# EAGLE design Zio Rotary Encoder Sensor (EAGLE 8.6.1)
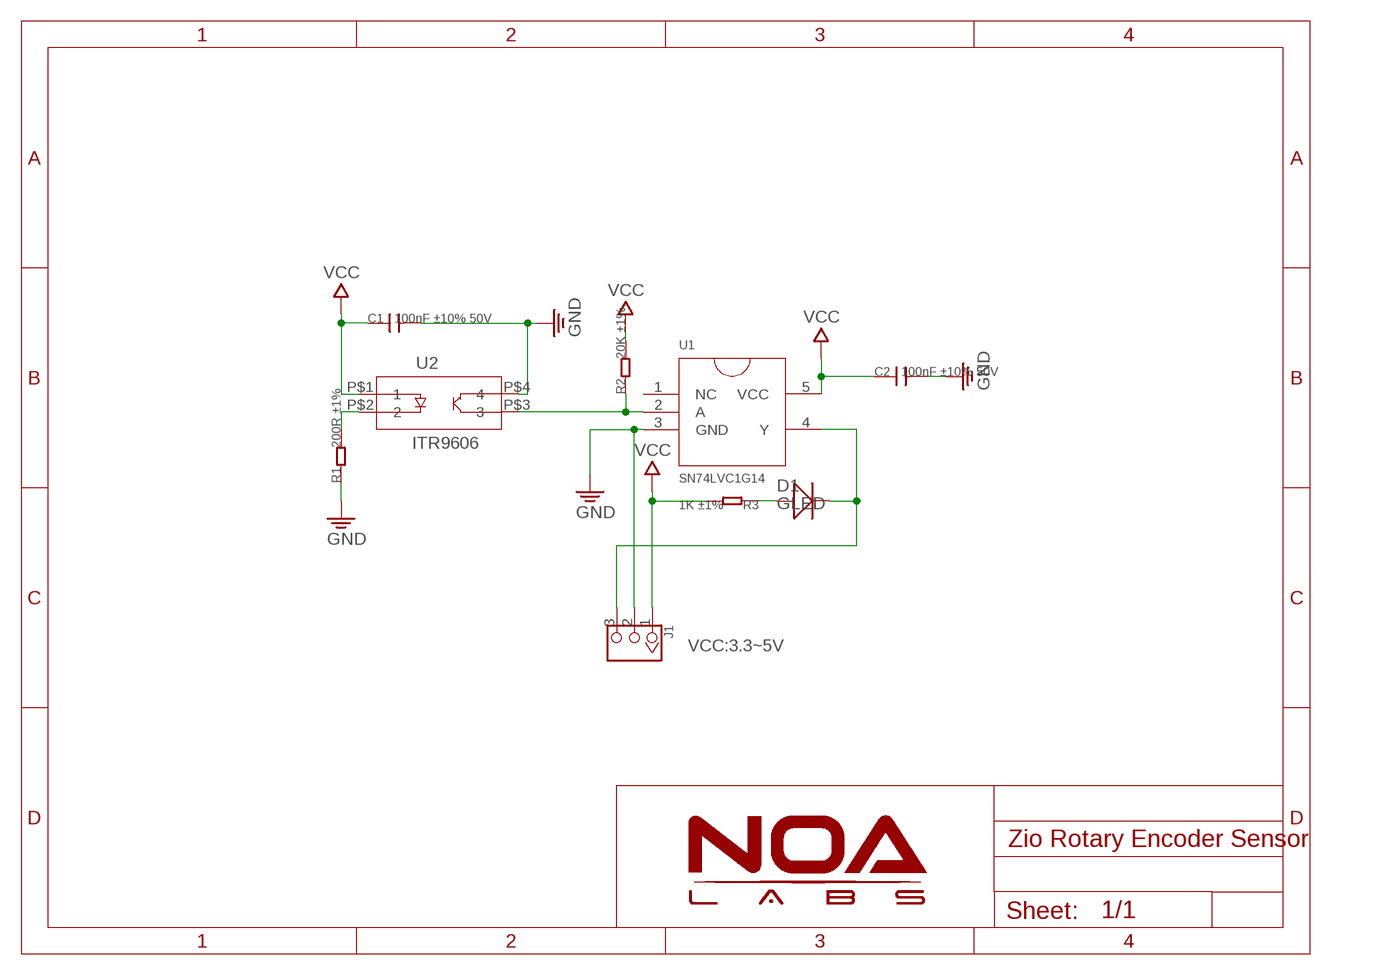
[diagram p0: schematic, sheet 1]

## Parts
C1  100nF ±10% 50V  C-0603  [0603]
C2  100nF ±10% 50V  C-0603  [0603]
D1  GLED  D-0603  [SOD523]
J1  HEADER-3P-2.54  [3P-2.54]
R1  200R ±1%  R-0603  [0603]
R2  20K ±1%  R-0603  [0603]
R3  1K ±1%  R-0603  [0603]
U1  SN74LVC1G14  [SOT23-5]
U2  ITR9606  [ITR9606]

## Nets
GND: C1.2 C2.2 J1.2 R1.1 U1.3(GND) U2.P$4
N$1: R1.2 U2.P$2
N$2: R2.1 U1.2(A) U2.P$3
N$4: D1.+ R3.1
N$5: D1.- J1.3 U1.4(Y)
VCC: C1.1 C2.1 J1.1 R2.2 R3.2 U1.5(VCC) U2.P$1
Unconnected: U1.1(NC)

## Notes on the sheet
- VCC:3.3~5V

## Library data of the parts
C1 C2 = Discretex:C*: Ceramic Capacitors
D1 = Discretex:D*
J1 = Connector:HEADER-3P
R1-R3 = Discretex:R*
U1 = IC:SN74LVC1G14
U2 = Discretex:ITR9606

## Board
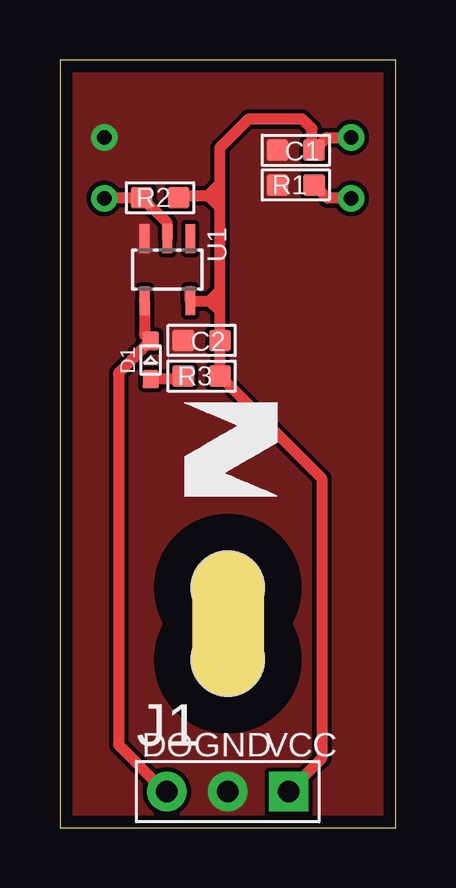
[diagram p1: board, top side]
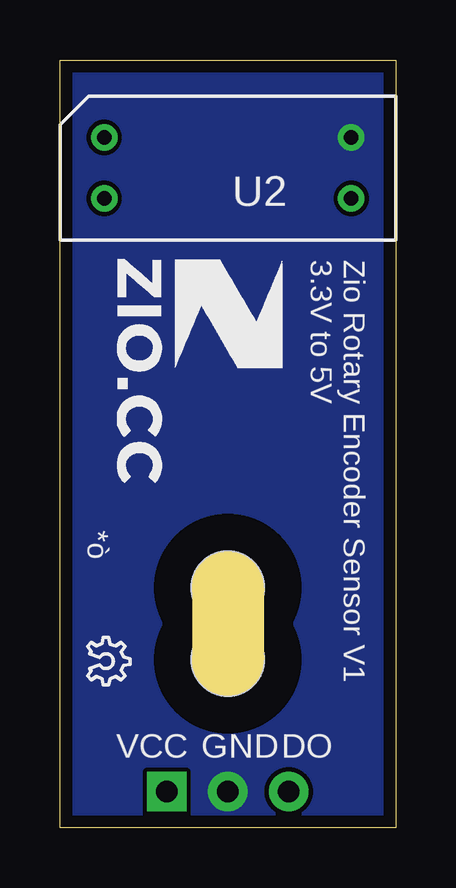
[diagram p2: board, bottom side, seen from below]

Size 14 x 32 mm. Coordinates in mm from the lower left corner, seen from the top.
Outline: 0,0 14,0 14,32 0,32 0,0
Copper layers (1*16): Top 0.035mm / dielectric 1.5mm / Bottom 0.035mm
Design rules "NOA Eagle Rule": minimum track width 7mil, minimum drill 12mil, track to track 7mil, track to pad 7mil, pad to pad 7mil, via to via 7mil, smd to smd 0mil, copper to edge 20mil, drill to drill 10mil, minimum pad ring 10mil, minimum via ring 6mil, stop-mask expansion 2mil, vias tented up to drill 25mil, thermal gap 10mil
Holes 3 mm at 7,7 7,10
tRestrict: area 4,4 to 10,10; area 4,7 to 10,13
bRestrict: area 4,4 to 10,10; area 4,7 to 10,13
Milling: 1 lines

### Footprints (pad centres in the part's own frame; a part is rotated, then mirrored left to right if it is on the bottom)
0603 = smd 0.889 x 0.889: 1 -0.762,0; 2 0.762,0
SOD523 = smd 0.762 x 0.7: + -0.8,0; - 0.8,0
3P-2.54 = drill 0.889 pad 1.651 square: 1 0,2.54 | drill 0.889 pad 1.651: 2 0,0; 3 0,-2.54
SOT23-5 = smd 0.4 x 1.2: 1 -0.95,-1.3; 2 0,-1.3; 3 0.95,-1.3; 4 0.95,1.3; 5 -0.95,1.3
ITR9606 = drill 0.6: P$1 -5.15,1.27; P$2 -5.15,-1.27; P$3 5.15,-1.27; P$4 5.15,1.27

### Placement (x,y rotation side)
C1  9.83,28.24 180 top
C2  5.91,20.31 180 top
D1  3.78,19.49 90 top
J1  7,1.5 270 top
R1  9.84,26.78 0 top
R2  4.18,26.26 0 top
R3  5.91,18.81 0 top
U1  4.48,23.26 180 top
U2  7,27.5 0 bottom
U$5  [6MM]  5.18,13.79 0 top
U$6  [7MM]  11.61,23.67 270 bottom
U$7  [OSHW_6X70_NOTEXT]  12.85,7.92 270 bottom

### Tracks (layer width: path | path; a pad name or v marks a point on that pad's centre or on a via)
GND
  pour Top (no thermals): 0,32 14,32 14,0 0,0
  pour Bottom (no thermals): 0,32 14,32 14,0 0,0
N$1
  Top 0.457: U2.P$2 11.16,26.23 R1.2
N$2
  Top 0.457: U2.P$3 1.88,26.26 R2.1 4.48,25.19 U1.2
N$4
  Top 0.457: R3.1 5.02,18.69 D1.+
N$5
  Top 0.457: J1.3 4.39,1.5 2.44,3.45 2.44,18.95 D1.- 3.53,20.55 U1.4
VCC
  Top 0.457: J1.1 10.92,2.88 10.92,14.56 R3.2 C2.1 | U2.P$1 11.13,28.77 C1.1 10.52,28.32 10.52,29.13 10.11,29.54 7.87,29.54 6.67,28.34 6.67,26.84 | 5.43,22.35 U1.5 6.25,21.96 | 6.67,20.72 C2.1 | C2.1 6.67,21.54 | 6.67,21.54 6.67,22.05 | 6.67,22.05 6.67,22.38 | 6.67,22.38 6.67,25.84 | 6.67,25.84 6.67,26.34 | 6.67,26.34 6.67,26.84 | R2.2 5.02,26.34 6.17,26.34 | 6.17,26.34 6.67,26.34 | 6.17,26.34 6.67,26.84 | 6.17,26.34 6.67,25.84 | 6.25,21.96 6.58,21.96 6.67,22.05 | 6.25,21.96 6.67,22.38 | 6.25,21.96 6.67,21.54

### Text on the board
tPlace: DO | GND | VCC
bPlace: Zio Rotary Encoder Sensor V1 / 3.3V to 5V | *ò | DO | GND | VCC